# EasyEDA schematic SCH_fateh_reverse_voltage_protection_circuit0_draft1.json
TITLE: Sheet_1; REV: 1.0; Date: 2022-05-10; Sheet: 1/1; Company: Your Company
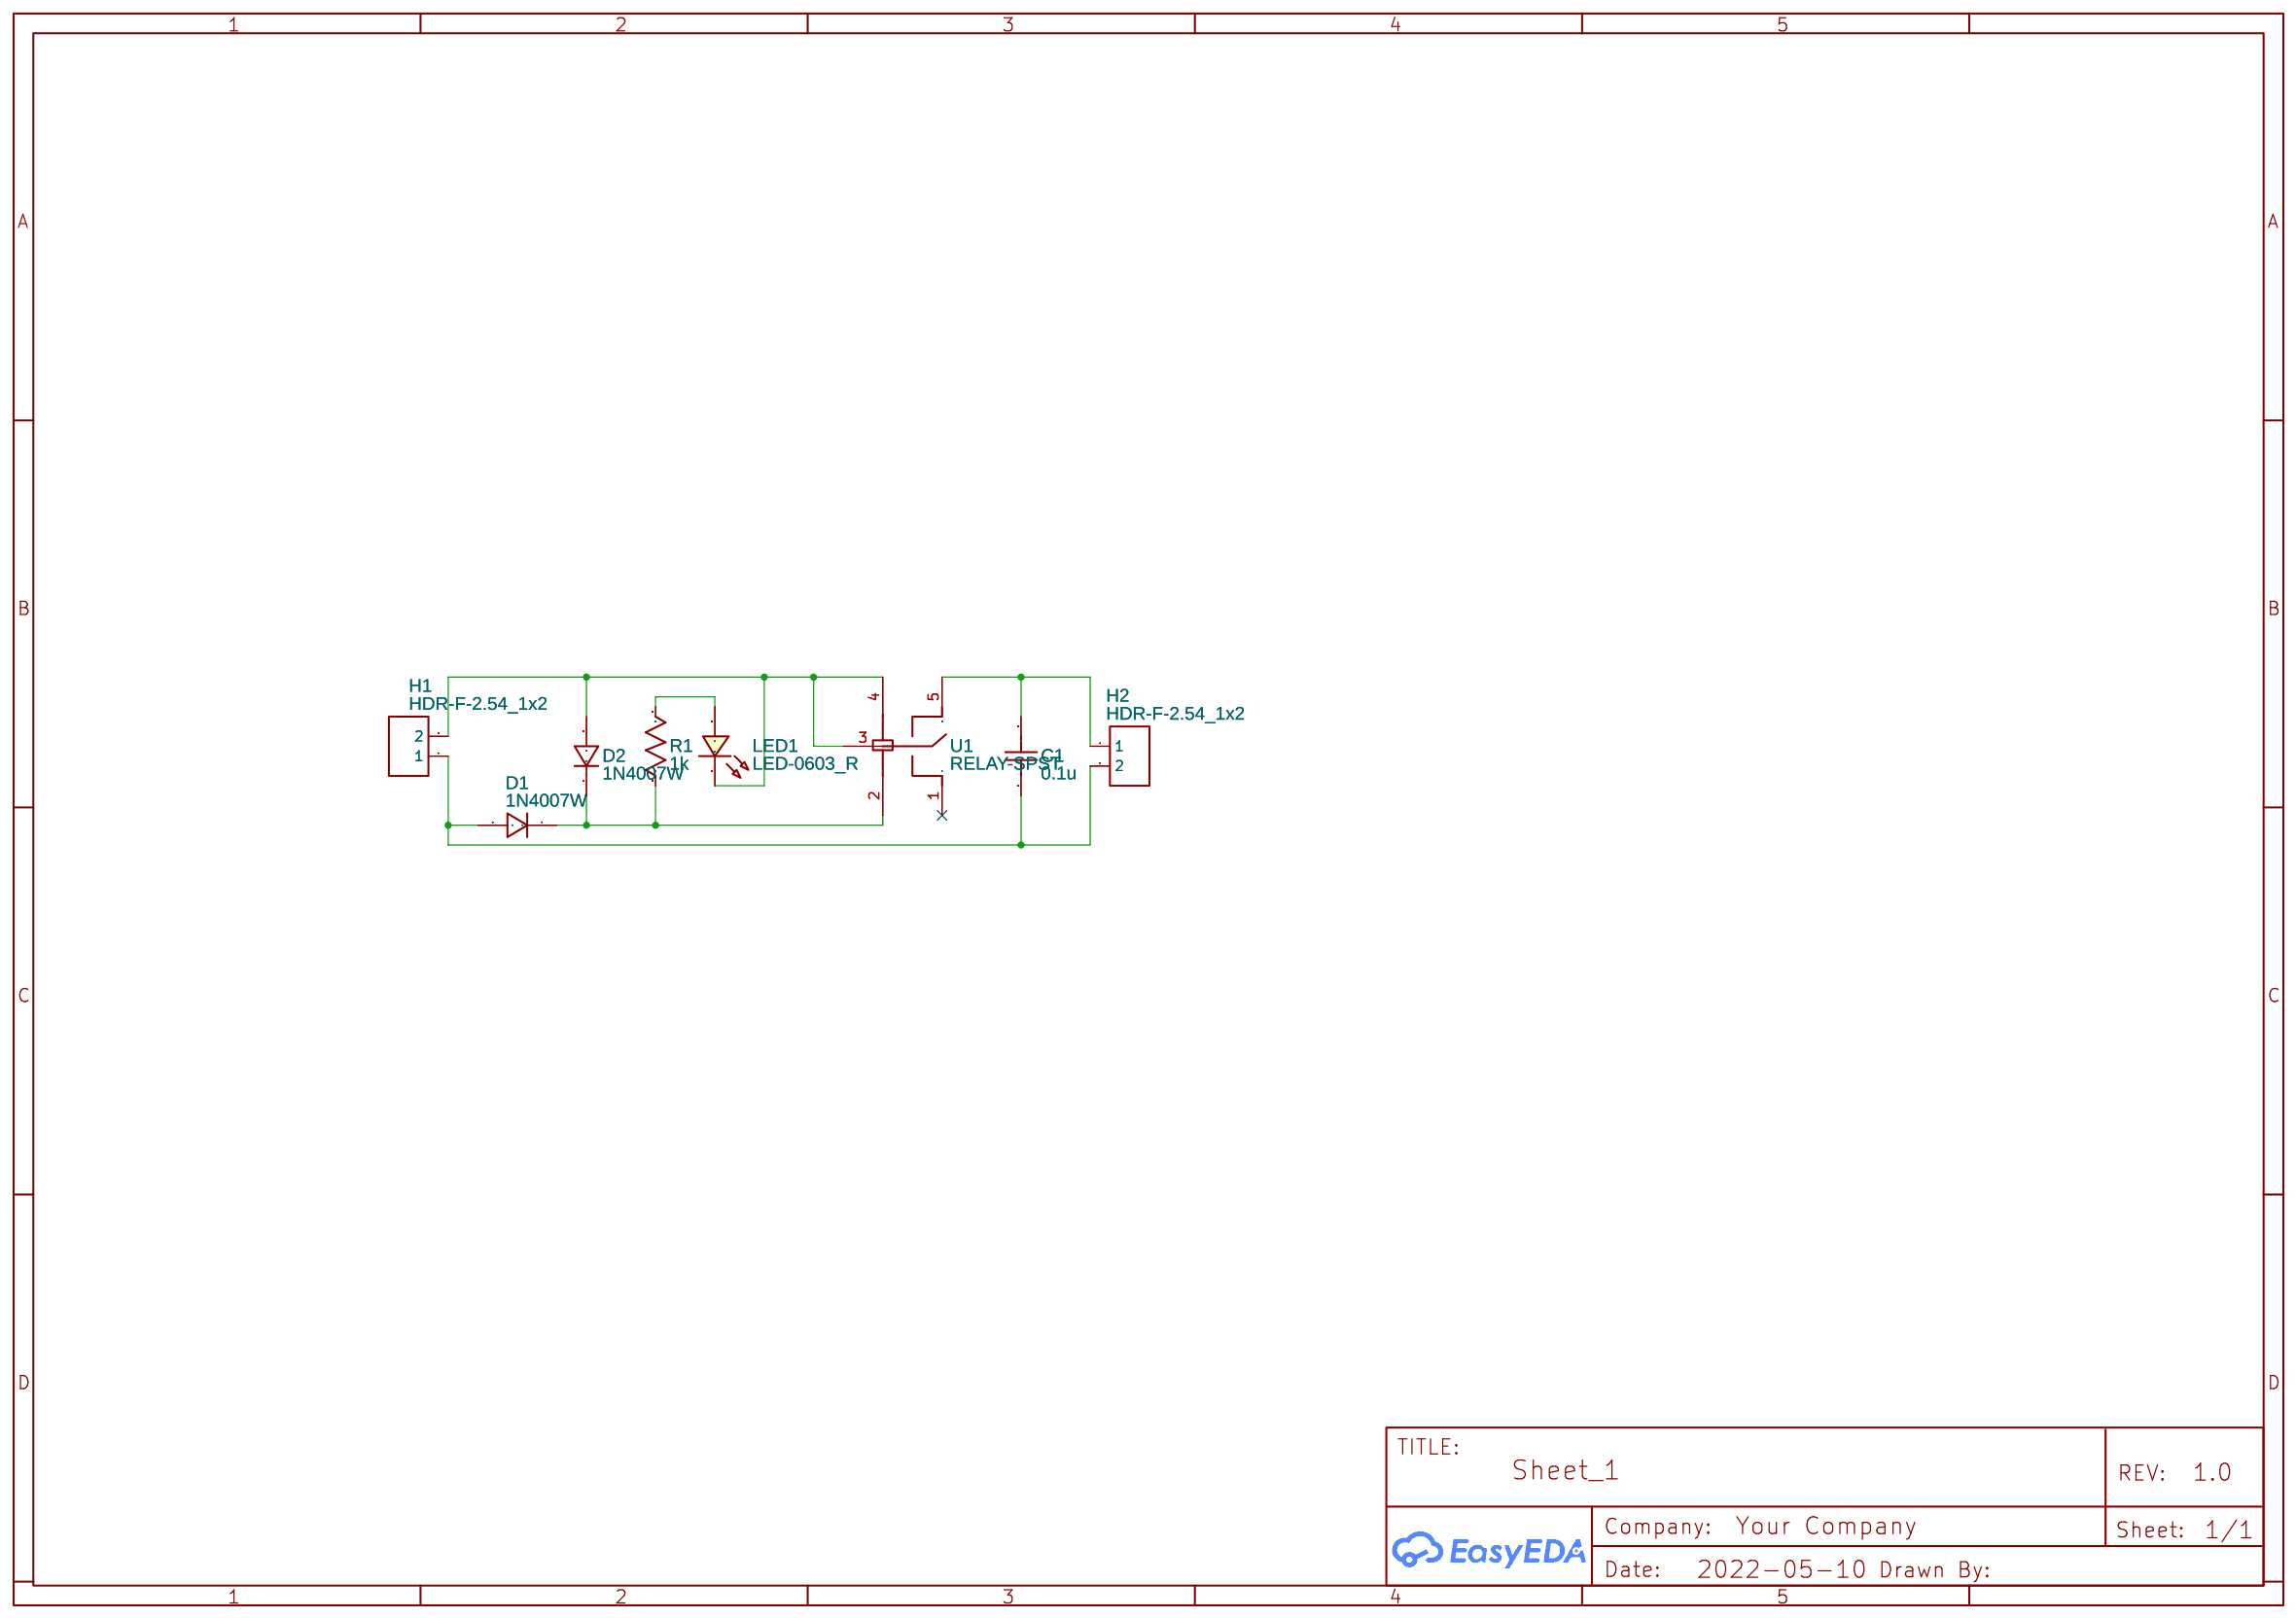
[diagram p0: schematic sheet]

## Parts
C1  0.1u  [C0603]
D1  1N4007W  [SOD-123_L2.8-W1.8-LS3.7-RD]
D2  1N4007W  [SOD-123_L2.8-W1.8-LS3.7-RD]
H1  HDR-F-2.54_1x2  [HDR-F-2.54_1X2]
H2  HDR-F-2.54_1x2  [HDR-F-2.54_1X2]
LED1  LED-0603_R  [LED0603_RED]
R1  1k  [R_AXIAL-0.3]
U1  RELAY-SPST  [RELAY-TH_RELAY-SPST]

## Library data of the parts
C1 = C_0603_US: Contributor: LCEDA_Lib
D1 D2 = 1N4007W: Supplier: LCSC; Supplier Part: C328592; Manufacturer: BLUE ROCKET; Contributor: LCEDA_Lib
H1 H2 = HDR-F-2.54_1x2: Supplier Part: C49661; Supplier: LCSC; Contributor: LCEDA_Lib
LED1 = LED-0603_R: Manufacturer: EVERLIGHT(台湾亿光); Manufacturer Part: 19-217/R6C-AL1M2VY/3T; Supplier Part: C72044; Supplier: LCSC; Contributor: LCEDA_01
R1 = R_AXIAL-0.3_US: Contributor: LCEDA_Lib
U1 = RELAY-SPST: Supplier: LCSC; Supplier Part: C2941249; Manufacturer: null; Manufacturer Part: Relay-SPST; JLCPCB Part Class: Extended Part; Contributor: LCSC

## Nets
Net-(C1-1): C1.1 D1.2 H1.1 H2.2
Net-(C1-2): C1.2 H2.1 U1.5
Net-(D1-1): D1.1 D2.1 R1.2 U1.2
Net-(D2-2): D2.2 H1.2 LED1.2 U1.3 U1.4
Net-(LED1-1): LED1.1 R1.1

Not connected (* = marked no-connect by the designer): U1 1*
